# EAGLE design H-Bridge (EAGLE 6.4)
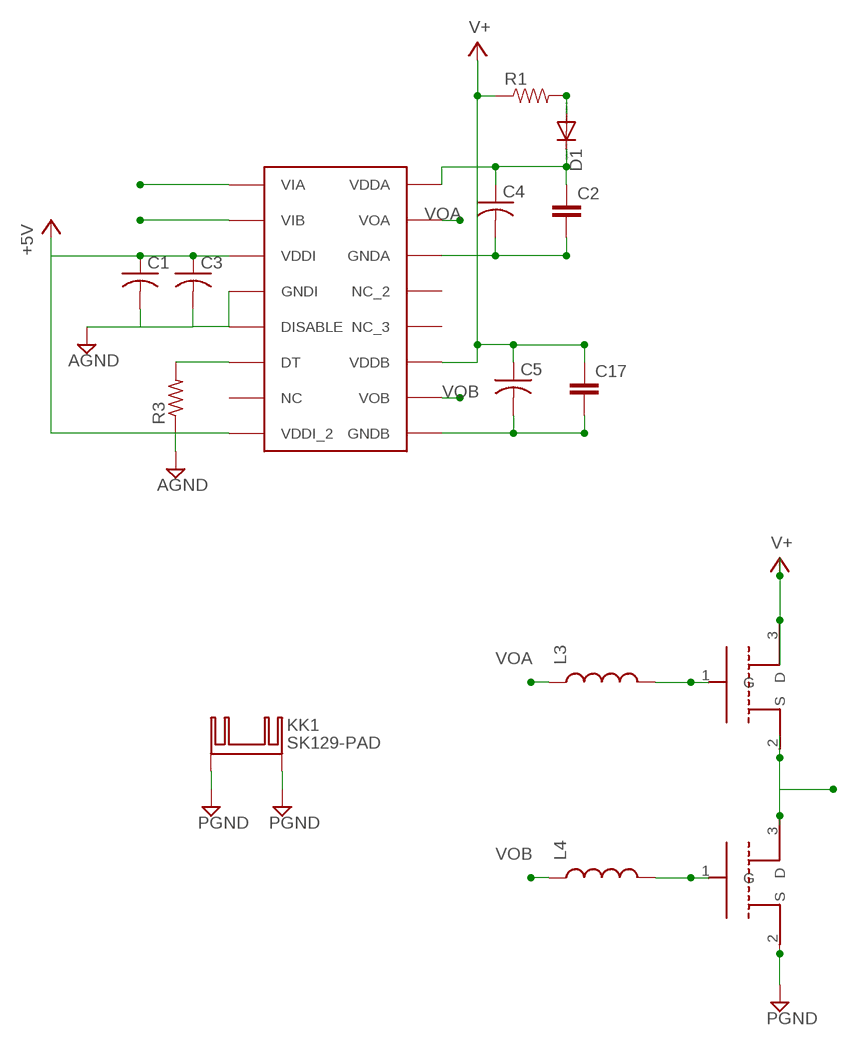
[diagram p0: schematic, sheet 1]

## Parts
C1  C-USC0603K  [C0603K]
C2  CAP0805  [0805]
C3  C-USC0603K  [C0603K]
C4  C-USC0805K  [C0805K]
C5  C-USC0805K  [C0805K]
C17  CAP0805  [0805]
D1  DIODE-DO214BA  [DO214BA]
KK1  SK129-PAD  [SK129]
L3  INDUCTOR0805  [0805]
L4  INDUCTOR0805  [0805]
R1  RESISTOR0805-RES  [0805]
R3  R-US_R0603  [R0603]
U$2  MCP3008_ADC  [SOIC16]
U$3  HEMT-FET  [TO220V]
U$4  HEMT-FET  [TO220V]

## Nets
+5V: C1.1 C3.1 U$2.VDDI U$2.VDDI_2
AGND: C1.2 C3.2 R3.1 U$2.DISABLE U$2.GNDI
GNDA: C2.2 C4.2 U$2.GNDA U$3.3(D) U$4.2(S)
N$2: D1.A R1.2
N$3: C2.1 C4.1 D1.C U$2.VDDA
N$4: L3.2 U$4.1(G)
N$6: L4.2 U$3.1(G)
N$8: U$4.3(D) ; supply symbol labelled V+
N$9: R3.2 U$2.DT
PGND: C5.2 C17.2 KK1.A2,5(K) KK1.B2,5(K) U$2.GNDB U$3.2(S)
V+: C5.1 C17.1 R1.1 U$2.VDDB
VIA: U$2.VIA
VIB: U$2.VIB
VOA: L3.1 U$2.VOA
VOB: L4.1 U$2.VOB
Unconnected: U$2.NC U$2.NC_2 U$2.NC_3

## Library data of the parts
C1 C3-C5 = rcl:C-US: CAPACITOR, American symbol
C2 C17 = SparkFun-Passives:CAP: Capacitor Standard 0603 ceramic capacitor, and 0.1" leaded capacitor.
D1 = diode:DIODE-: DIODE
KK1 = heatsink:SK129-PAD: HEATSINK manufacturer Fischer/distributor Buerklin
L3 L4 = SparkFun-Passives:INDUCTOR: Inductors Basic Inductor/Choke - 0603 and 1206. Footprints are not proven and vary greatly between part numbers. SRN6045- 33uH, 20% 1.4A SDR0403-560KL - 56uH, 10%, 500mA RMS/740mA peak
R1 = SparkFun-Resistors:RESISTOR: Resistor Basic schematic elements and footprints for 0603, 1206, and PTH resistors.
R3 = resistor:R-US_: RESISTOR, American symbol
U$2 = SI8230:3:MCP3008_ADC
U$3 U$4 = SparkFun-DiscreteSemi:HEMT-FET

## Board
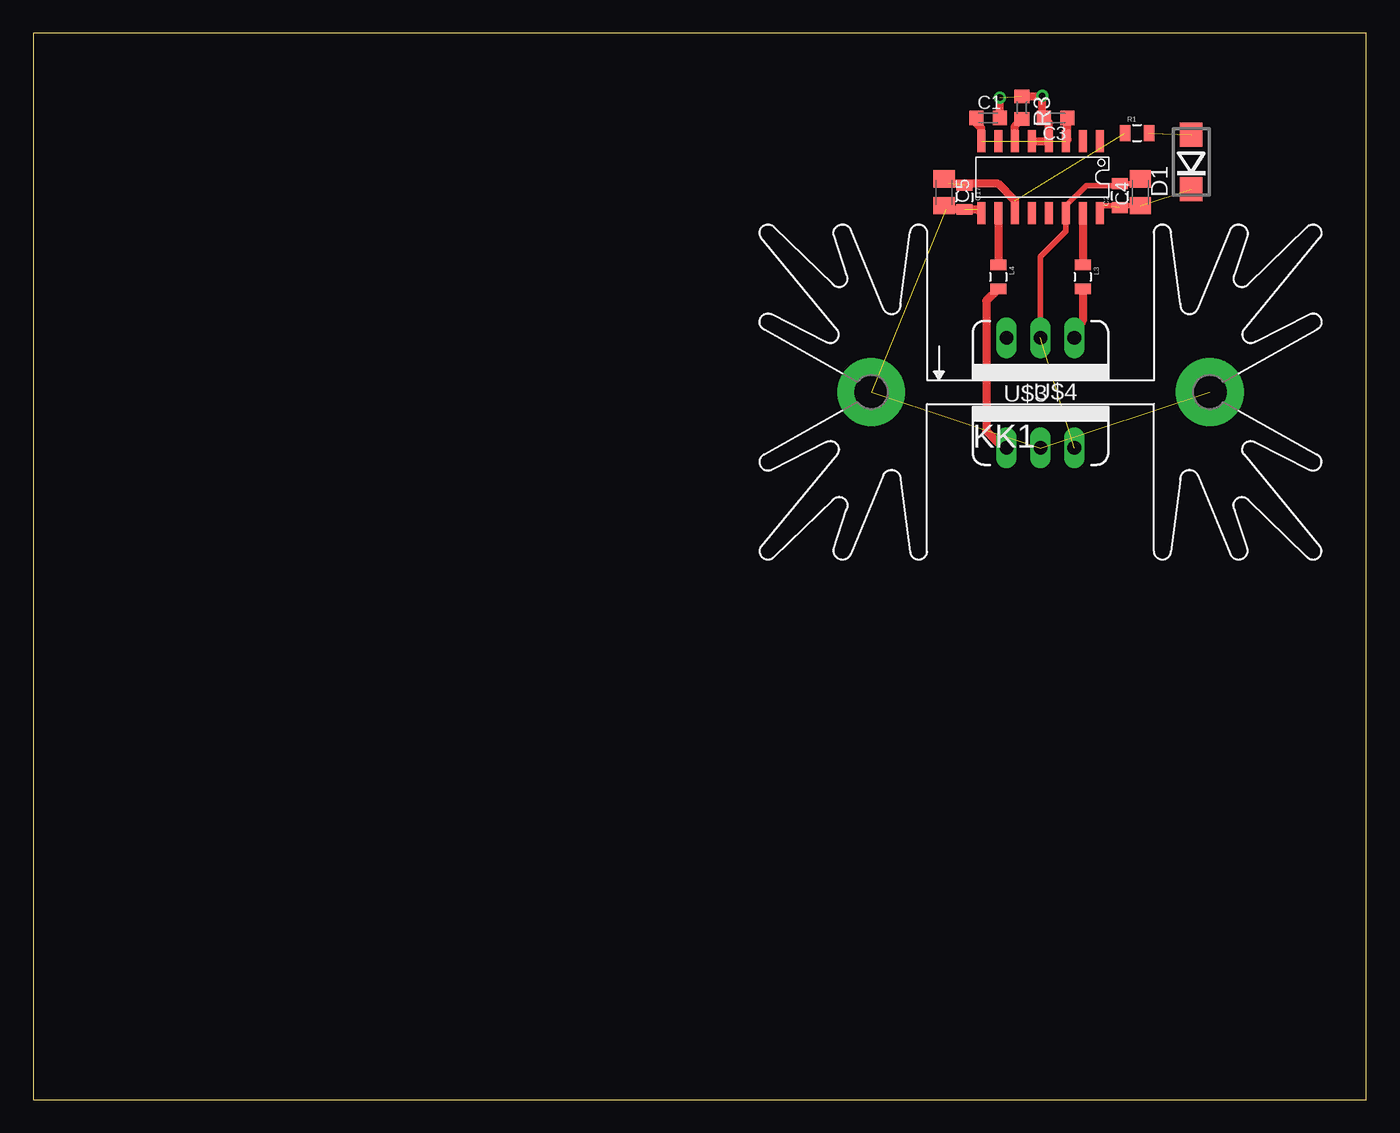
[diagram p1: board, top side]
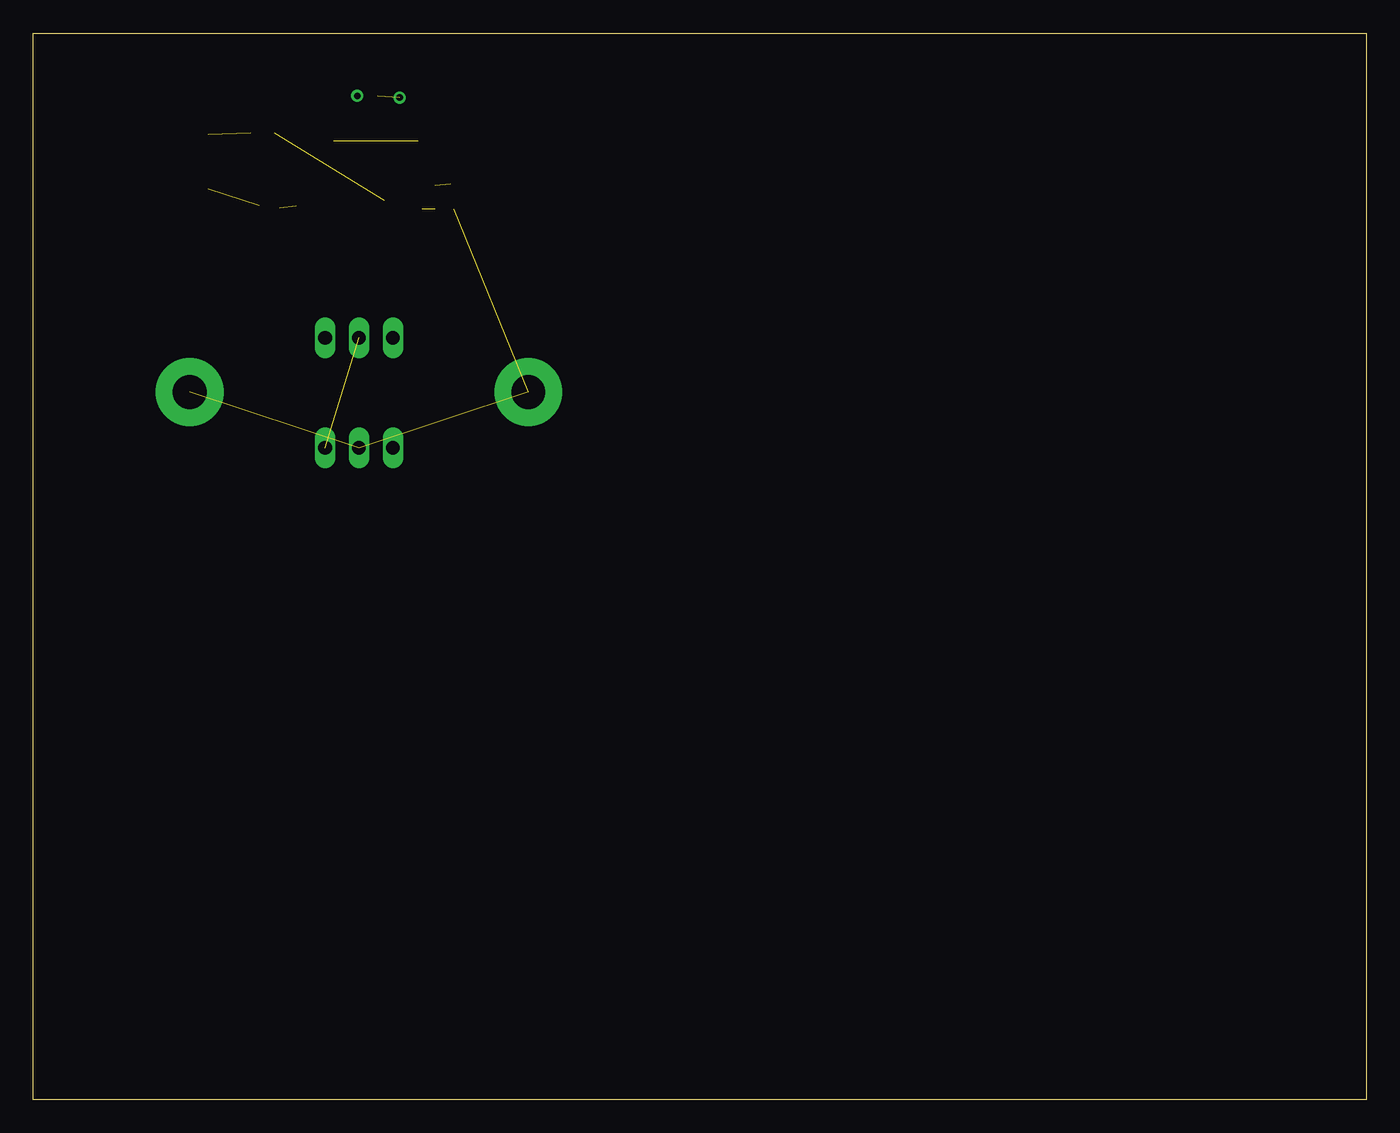
[diagram p2: board, bottom side, seen from below]

Size 100 x 80 mm. Coordinates in mm from the lower left corner, seen from the top.
Outline: 0,0 100,0 100,80 0,80 0,0
Copper layers (1*16): Top 0.035mm / dielectric 1.5mm / Bottom 0.035mm
Design rules "default": minimum track width 10mil, minimum drill 24mil, track to track 8mil, track to pad 8mil, pad to pad 8mil, via to via 8mil, smd to smd 8mil, copper to edge 40mil, drill to drill 8mil, minimum pad ring 10mil, minimum via ring 8mil, stop-mask expansion 4mil, vias tented up to drill 0mil, thermal gap 10mil

### Footprints (pad centres in the part's own frame; a part is rotated, then mirrored left to right if it is on the bottom)
C0603K = smd 1.05 x 1.08: 1 -0.875,0; 2 0.875,0
0805 = smd 0.8 x 1.2: 1 -0.9,0; 2 0.9,0
C0805K = smd 1.3 x 1.6: 1 -1,0; 2 1,0
DO214BA = smd 1.8 x 1.7: A 2.05,0; C -2.05,0
SK129 = drill 2.54 pad 5.08: A2,5 -12.7,-0.889; B2,5 12.7,-0.889
R0603 = smd 1 x 1.1: 1 -0.85,0; 2 0.85,0
SOIC16 = smd 1.65 x 0.6: DISABLE -2.7,-1.27; DT -2.7,-2.54; GNDA 2.7,1.27; GNDB 2.7,-5.08; GNDI -2.7,0; NC -2.7,-3.81; NC_2 2.7,0; NC_3 2.7,-1.27; VDDA 2.7,3.81; VDDB 2.7,-2.54; VDDI -2.7,1.27; VDDI_2 -2.7,-5.08; VIA -2.7,3.81; VIB -2.7,2.54; VOA 2.7,2.54; VOB 2.7,-3.81
TO220V = drill 1.016 long: 1 -2.54,0; 2 0,0; 3 2.54,0

### Placement (x,y rotation side)
C1  71.63,73.66 0 top
C2  81.53,67.82 90 top
C3  76.71,73.66 180 top
C4  83.06,68.07 90 top
C5  68.33,68.07 270 top
C17  69.85,67.69 270 top
D1  86.87,70.36 90 top
KK1  75.56,53.97 0 top
L3  78.74,61.72 270 top
L4  72.39,61.72 270 top
R1  82.8,72.52 0 top
R3  74.17,74.42 270 top
U$2  76.2,69.22 270 top
U$3  75.56,48.89 0 top
U$4  75.56,57.15 180 top

### Tracks (layer width: path | path; a pad name or v marks a point on that pad's centre or on a via)
+5V  (1 unrouted)
  Top 0.61: U$2.VDDI_2 71.12,72.9 70.75,73.27 C1.1 | U$2.VDDI 77.58,72.03 C3.1
AGND  (via drill 0.5)  (1 unrouted)
  Top 0.61: U$2.DISABLE U$2.GNDI 76.2,73.28 C3.2 75.69,73.66 v75.69,75.31 75.69,75.27 R3.1 | C1.2 72.52,73.66 v72.52,75.18
  Bottom 0.61: v75.69,75.31 75.82,75.31 | v72.52,75.18 72.52,75.31
GNDA  (1 unrouted)
  Top 0.406: C4.2 82.7,68.72 C2.2 81.4,68.58 78.99,68.58 77.47,67.06 U$2.GNDA 77.47,65.15 75.56,63.25 U$4.2
N$2  (1 unrouted)
N$3  (2 unrouted)
  Top 0.406: U$2.VDDA 80.01,66.8 80.28,67.07 C4.1
N$4
  Top 0.61: L3.2 78.74,58.42 78.11,57.78 U$4.1
N$6
  Top 0.61: L4.2 71.5,59.93 71.5,50.17 72.77,48.89 U$3.1
N$9
  Top 0.61: U$2.DT 73.66,73.06 R3.2
PGND  (4 unrouted)
  Top 0.61: C5.2 68.33,66.93 68.45,66.8 70.83,66.8 U$2.GNDB
V+  (2 unrouted)
  Top 0.61: U$2.VDDB 73.66,67.44 72.39,68.71 68.69,68.71 C5.1
VOA
  Top 0.61: U$2.VOA L3.1
VOB
  Top 0.61: U$2.VOB L4.1